# Altium schematic sheet all_in_a1.SchDoc
size 839 x 594 mm; CheckedBy: Журавлева Л. В.; Author: Синютина Д. С.; SheetNumber: 1; PageSetup: Record=PageOptions|CenterHorizontal=True|CenterVertical=True|PrintScale=0.94|XCorrection=1.00|YCorrection=1.00|PrintKind=1|BorderSize=5000000|LeftOffset=0|BottomOffset=0|Orientation=1|PaperLength=1000|PaperWidth=1000|Scale=100|PaperSource=7|PrintQuality=-4|MediaType=1|DitherType=10|PaperKind=A4|PrintScaleMode=1; DecimalNumber: ИУ4.11.03.03.21.08.81.12.003 Э3; MainDevice: ИУ4.11.03.03.21.08.81.12.024 СП; Time: 1
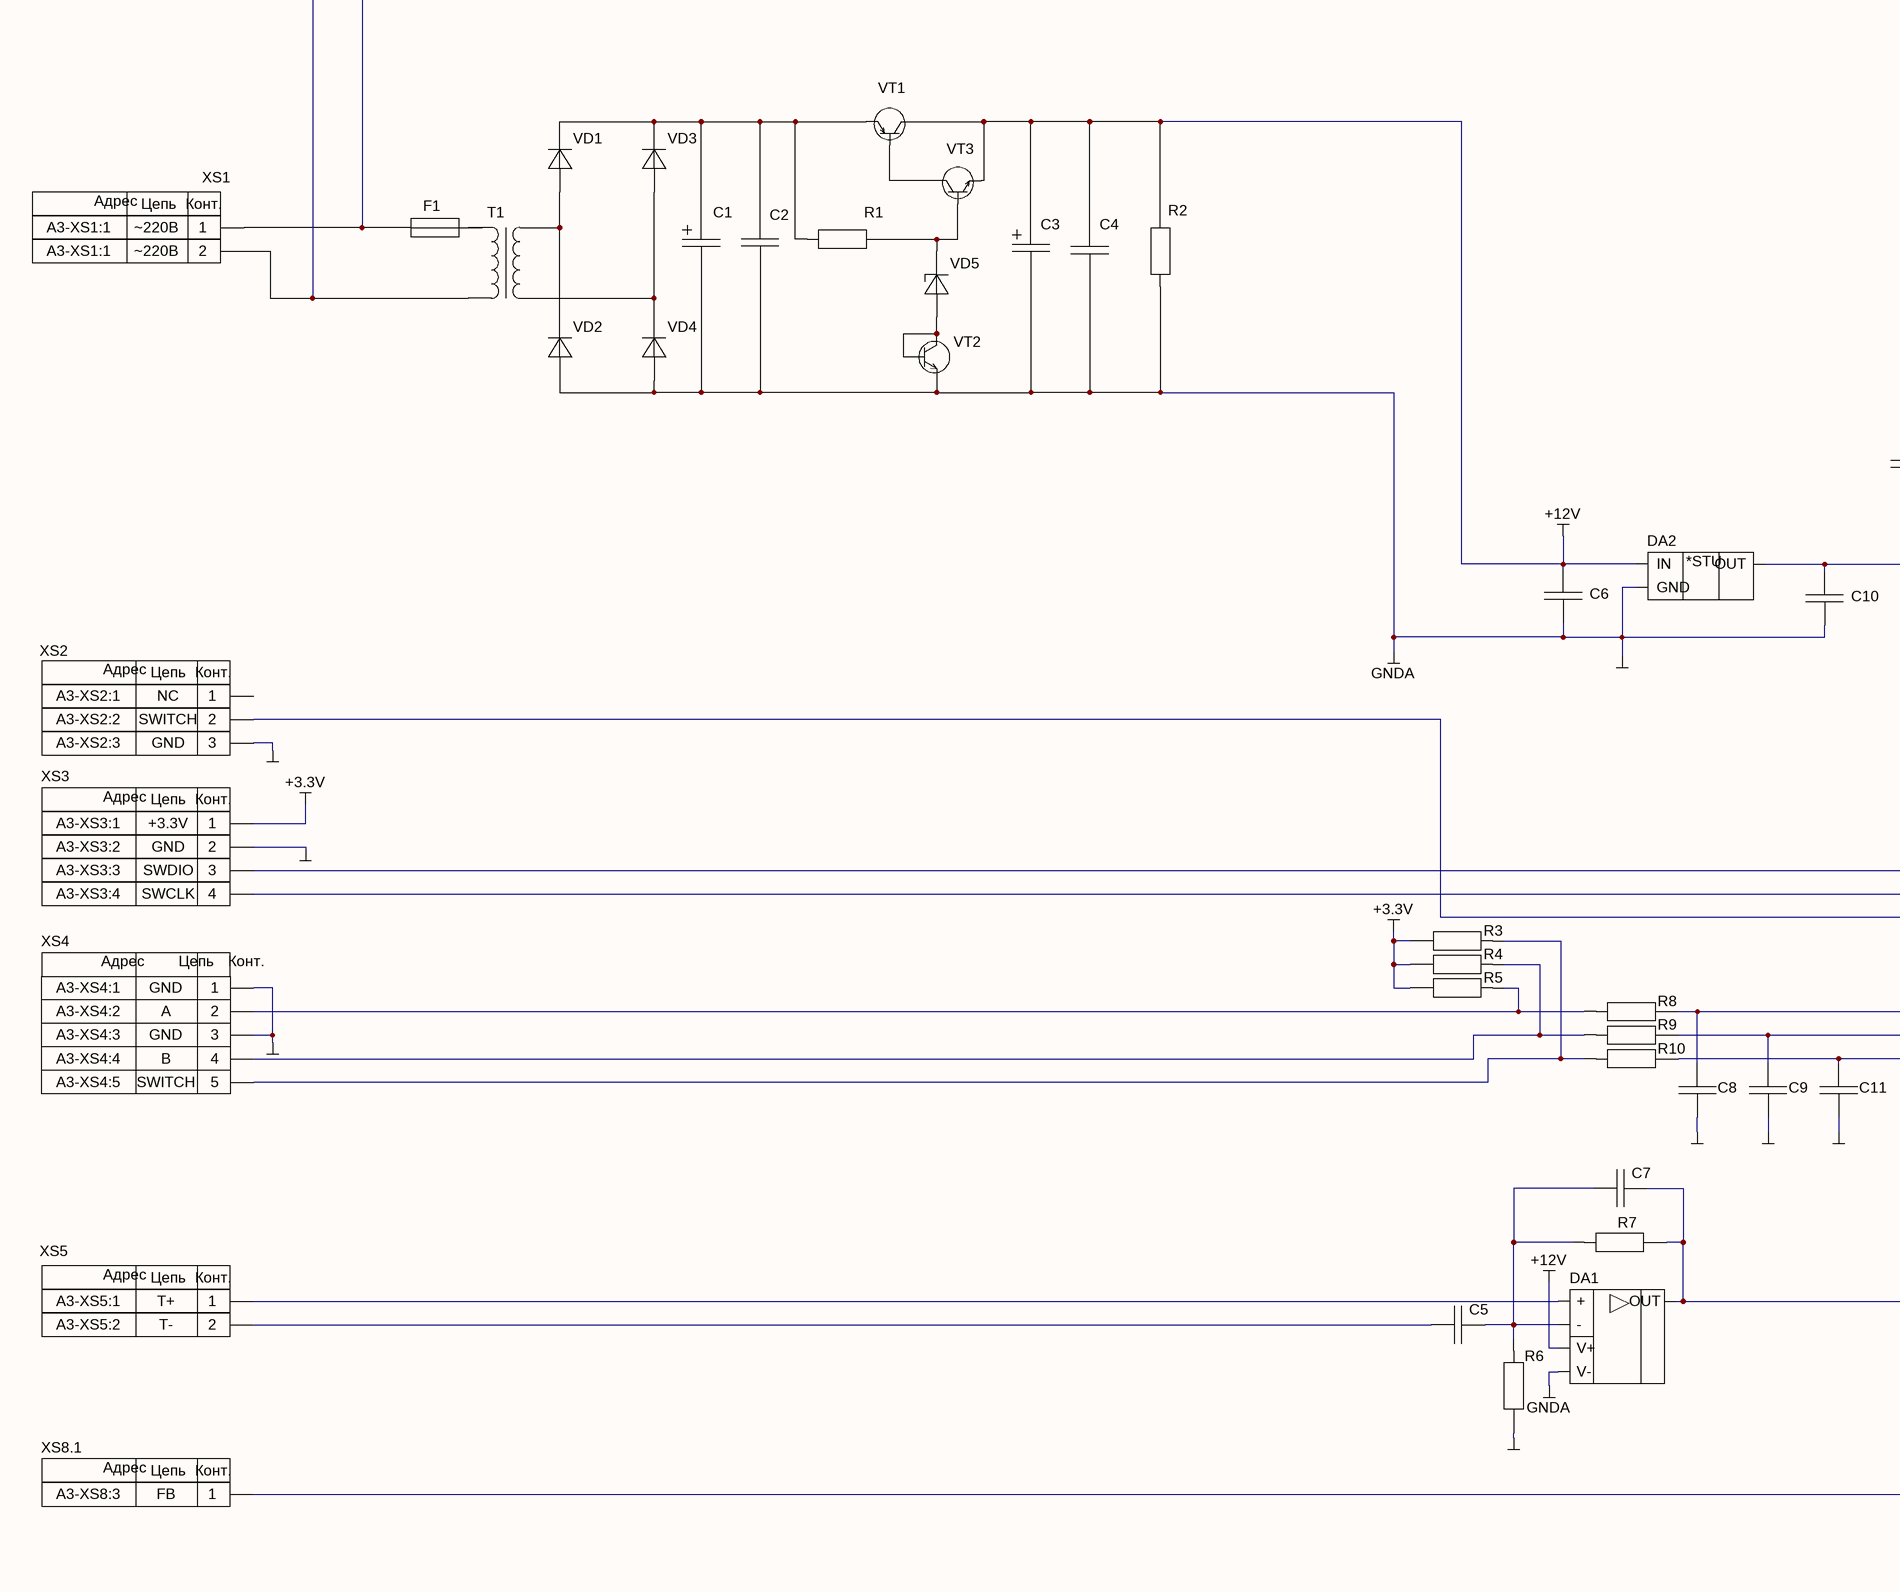
[diagram p0: all_in_a1.SchDoc, left]
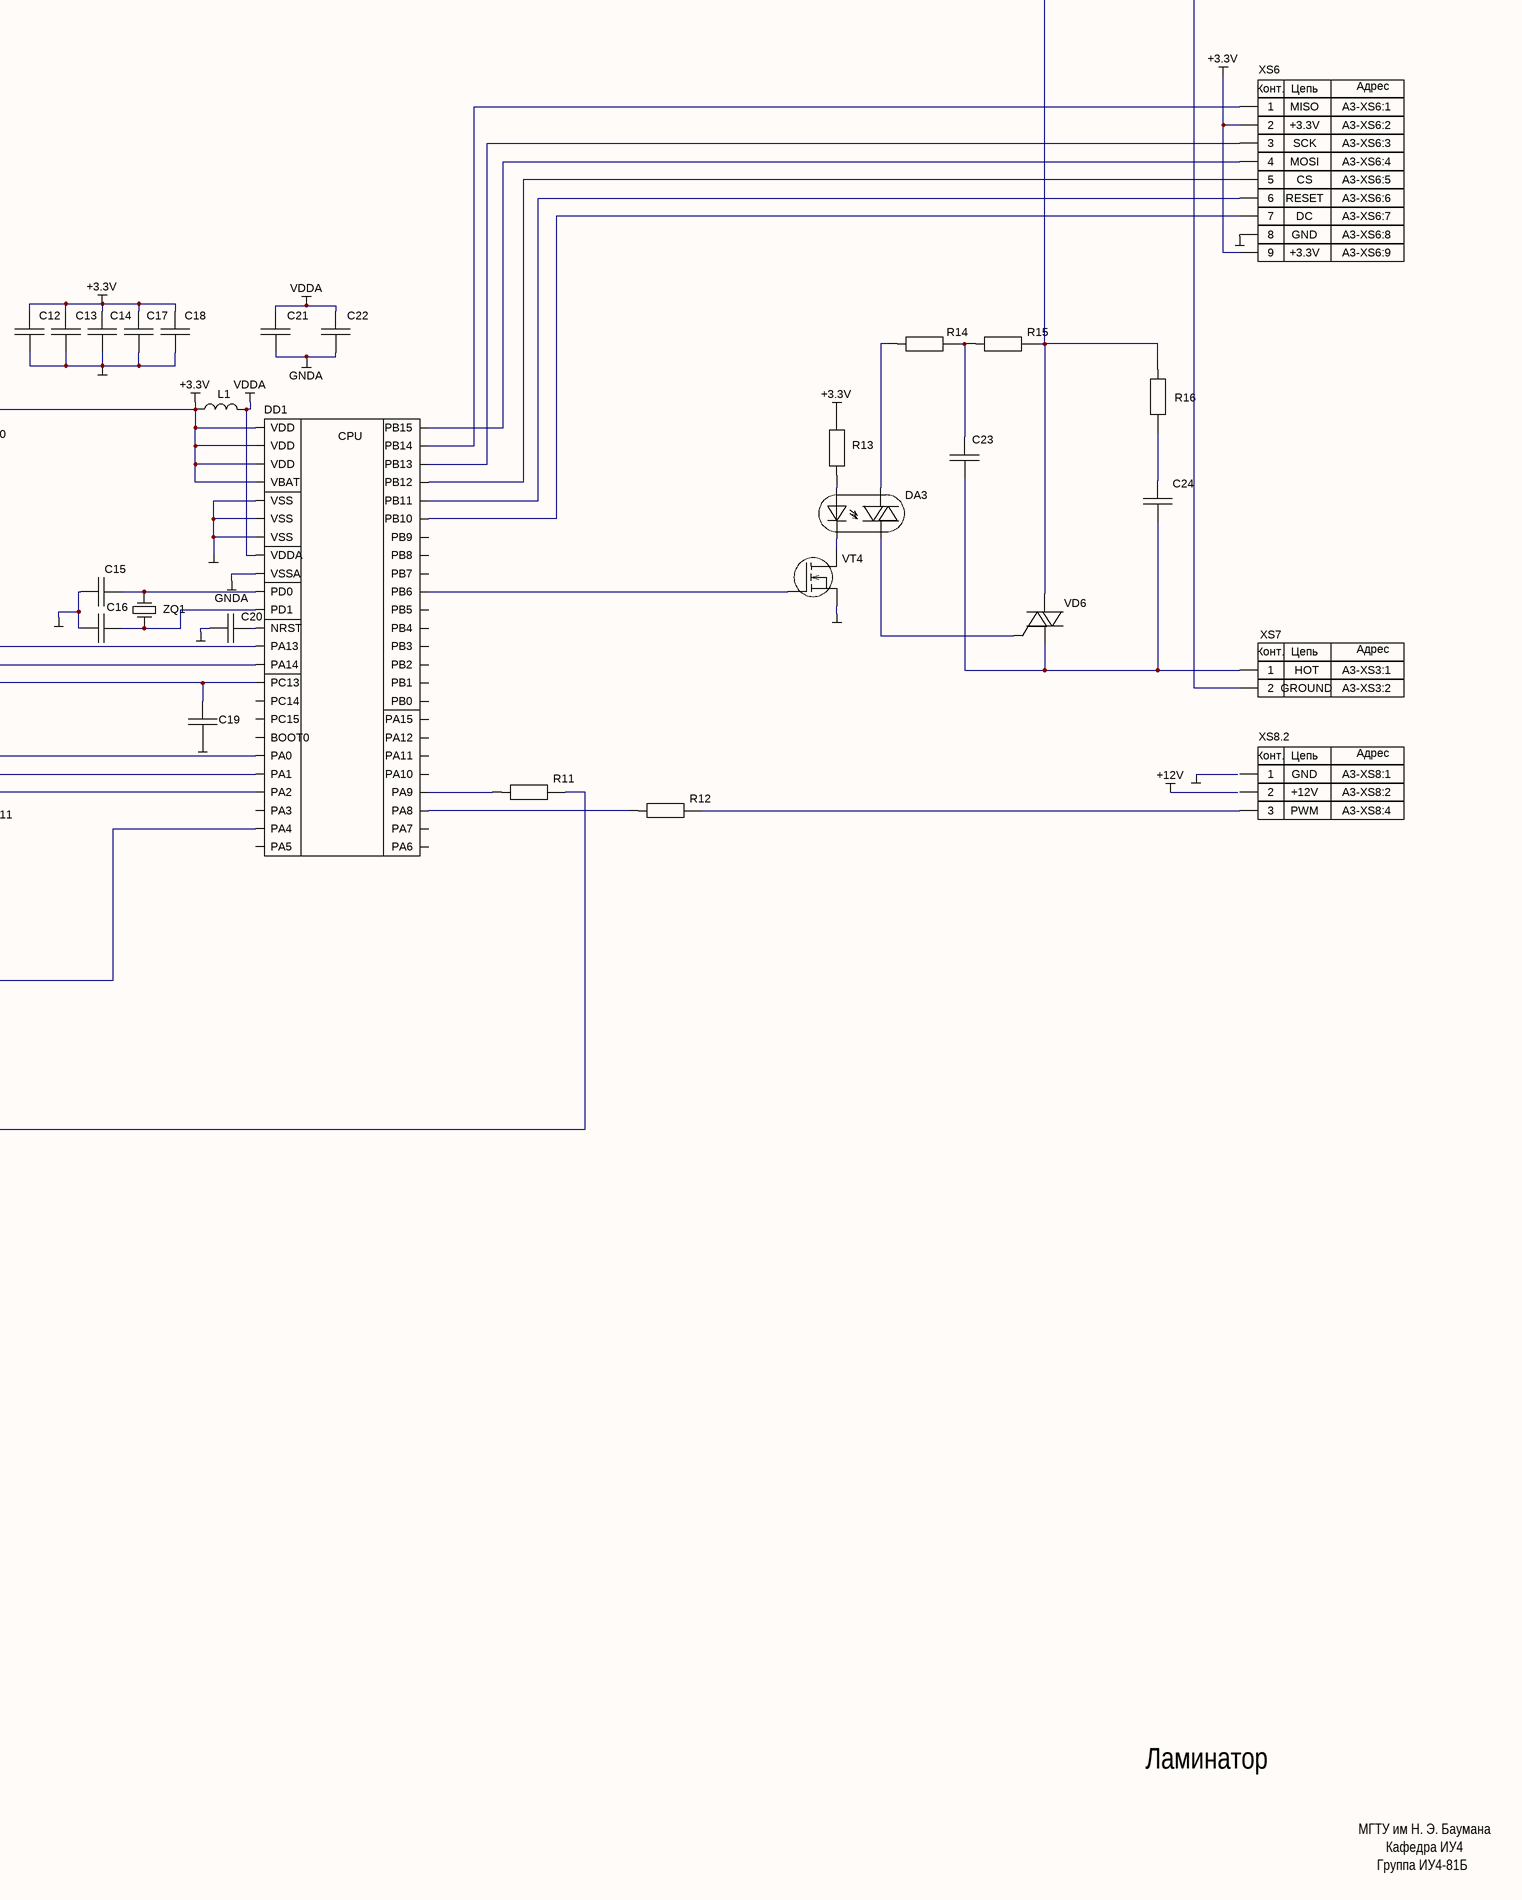
[diagram p1: all_in_a1.SchDoc, right]

## Parts
C1  1000 мкФ  [CAP: D10C5H20]  (value not drawn)
C2  100 нФ  [CAP: 1206]  (value not drawn)
C3  220 мкФ  [CAP: D6.3C2.5H11]  (value not drawn)
C4  100нФ  [CAP: 1206]  (value not drawn)
C5  100 нФ  [CAP: 0603]  (value not drawn)
C6  330 нФ  [CAP: 0603]  (value not drawn)
C7  100 нФ  [CAP: 0603]  (value not drawn)
C8  100 нФ  [CAP: 0603]  (value not drawn)
C9  100 нФ  [CAP: 0603]  (value not drawn)
C10  100 нФ  [CAP: 0603]  (value not drawn)
C11  100 нФ  [CAP: 0603]  (value not drawn)
C12  100 нФ  [CAP: 0603]  (value not drawn)
C13  100 нФ  [CAP: 0603]  (value not drawn)
C14  100 нФ  [CAP: 0603]  (value not drawn)
C15  22 pF  [CAP: 0603]  (value not drawn)
C16  22 pF  [CAP: 0603]  (value not drawn)
C17  100 нФ  [CAP: 0603]  (value not drawn)
C18  4.7 мкФ  [CAP: 0603]  (value not drawn)
C19  100 нФ  [CAP: 0603]  (value not drawn)
C20  100 нФ  [CAP: 0603]  (value not drawn)
C21  10 нФ  [CAP: 0603]  (value not drawn)
C22  1 мкФ  [CAP: 0603]  (value not drawn)
C23  10 нФ  [B32652]  (value not drawn)
C24  10 нФ  [B32652]  (value not drawn)
DA1  TS321ILT  [SOT23-5]  (value not drawn)
DA2  78xx  [SOT89]  (value not drawn)
DA3  MOC3020M  [DIP762W48P254L889H508Q6]  (value not drawn)
DD1  STM32F103C8T6  [48-LQFP]  (value not drawn)
F1  0.5 А  [FUSE: 0679H (BelFuse)]  (value not drawn)
L1  10 мкГн  [IND: 0805]  (value not drawn)
R1  330 Ом  [RES: 1206]  (value not drawn)
R2  1 кОм  [RES: 1206]  (value not drawn)
R3  10кОм  [RES: 0603]  (value not drawn)
R4  10кОм  [RES: 0603]  (value not drawn)
R5  10кОм  [RES: 0603]  (value not drawn)
R6  1 кОм  [RES: 1206]  (value not drawn)
R7  47 кОм  [RES: 1206]  (value not drawn)
R8  10кОм  [RES: 0603]  (value not drawn)
R9  10кОм  [RES: 0603]  (value not drawn)
R10  10кОм  [RES: 0603]  (value not drawn)
R11  220 Ом  [RES: 1206]  (value not drawn)
R12  220 Ом  [RES: 1206]  (value not drawn)
R13  Res  (value not drawn)
R14  Res  (value not drawn)
R15  Res  (value not drawn)
R16  Res  (value not drawn)
T1  Trans_1_1  [15v_0.7A_trans]  (value not drawn)
VD1  1n5400  [1n5400-1n5408]  (value not drawn)
VD2  1n5400  [1n5400-1n5408]  (value not drawn)
VD3  1n5400  [1n5400-1n5408]  (value not drawn)
VD4  1n5400  [1n5400-1n5408]  (value not drawn)
VD5  1n4742  [1n4728-1n4764]  (value not drawn)
VD6  BT137-600E  [TO220]  (value not drawn)
VT1  2SB1132T100Q  [SOT89]  (value not drawn)
VT2  2n4401  [TO-92]  (value not drawn)
VT3  2n4401  [TO-92]  (value not drawn)
VT4  FDV303N  [SOT23]  (value not drawn)
XS1  circuit2: ~220В  =address2: A3-XS1:1  [CON: DG350-3.5-02P]  (hidden comment: X2)
XS2  circuit1: NC  circuit2: SWITCH  circuit3: GND  =address1: A3-XS2:1  =address2: A3-XS2:2  =address3: A3-XS2:3  [CON: WF-03]  (hidden comment: X3)
XS3  circuit2: GND  circuit3: SWDIO  circuit1: +3.3V  circuit4: SWCLK  =address4: A3-XS3:4  =address3: A3-XS3:3  =address2: A3-XS3:2  =address1: A3-XS3:1  [CON: WF-04]  (hidden comment: X4)
XS4  cirtuit5: SWITCH  circuit4: B  circuit3: GND  circuit2: A  =address5: A3-XS4:5  =address4: A3-XS4:4  =address3: A3-XS4:3  =address2: A3-XS4:2  =address1: A3-XS4:1  [CON: CWF-5]  (hidden comment: X5)
XS5  circuit2: T-  circuit1: T+  =address2: A3-XS5:2  =address1: A3-XS5:1  [CON: WF-02]  (hidden comment: X2)
XS6  circtuit9: +3.3V  circtuit8: GND  circtuit7: DC  circtuit6: RESET  circtuit5: CS  circtuit4: MOSI  circtuit3: SCK  circtuit1: MISO  =address9: A3-XS6:9  =address8: A3-XS6:8  =address7: A3-XS6:7  =address5: A3-XS6:5  =address6: A3-XS6:6  =address4: A3-XS6:4  =address3: A3-XS6:3  =address2: A3-XS6:2  =address1: A3-XS6:1  [CON: IDC-10MS]  (hidden comment: X9)
XS7  circuit2: GROUND  circuit1: HOT  =address2: A3-XS3:2  =address1: A3-XS3:1  [CON: WF-02]  (hidden comment: X2)
XS8.1  address: A3-XS8:3  circuit: FB  (hidden comment: X1)
XS8.2  circuit1: GND  circuit2: +12V  circuit3: PWM  =address1: A3-XS8:1  =address2: A3-XS8:2  =address3: A3-XS8:4  (hidden comment: X3)
ZQ1  AT-41CD2-8MHz  [AT-41CD2]  (value not drawn)

## Nets
+3.3V: C10.2 C12.2 C13.2 C14.2 C17.2 C18.2 DA2.2(OUT) DD1.1(VBAT) DD1.24(VDD) DD1.36(VDD) DD1.48(VDD) L1.1 R3.2 R4.2 R5.2 R13.2 XS3.1 XS6.2 XS6.9
+12V: C3.1 C4.1 C6.2 DA1.5(V+) DA2.1(IN) R2.2 VT1.2(c) VT3.3(e)
GND: C1.2 C2.1 C3.2 C4.2 C6.1 C8.1 C9.1 C10.1 C11.1 C12.1 C13.1 C14.1 C15.1 C16.1 C17.1 C18.1 C19.1 C20.1 C21.1 C22.1 DA1.2(V-) DA2.3(GND) DD1.8(VSSA) DD1.23(VSS) DD1.35(VSS) DD1.47(VSS) R2.1 R6.2 VD2.1 VD4.1 VT2.3(e) VT4.3 XS2.3 XS3.2 XS4.1 XS4.3 XS6.8  [also labelled GNDA]
VDDA: C21.2 C22.2 DD1.9(VDDA) L1.2
NetC1_1: C1.1 C2.2 R1.1 VD1.2 VD3.2 VT1.3(e)
NetC5_1: C5.1 XS5.2
NetC5_2: C5.2 C7.1 DA1.3(-) R6.1 R7.1
NetC7_2: C7.2 DA1.4(OUT) DD1.14(PA4) R7.2
NetC8_2: C8.2 DD1.10(PA0) R8.2
NetC9_2: C9.2 DD1.11(PA1) R9.2
NetC11_2: C11.2 DD1.12(PA2) R10.2
NetC15_2: C15.2 DD1.5(PD0) ZQ1.1
NetC16_2: C16.2 DD1.6(PD1) ZQ1.2
NetC19_2: C19.2 DD1.2(PC13) XS2.2
NetC20_2: C20.2 DD1.7(NRST)
NetC23_1: C23.1 C24.1 VD6.1 XS7.1
NetC23_2: C23.2 R14.2 R15.1
NetC24_2: C24.2 R16.2
NetDA1_1: DA1.1(+) XS5.1
NetDA3_1: DA3.1 R13.1
NetDA3_2: DA3.2 VT4.2
NetDA3_3: DA3.3 R14.1
NetDA3_4: DA3.4 VD6.3
NetDD1_21: DD1.21(PB10) XS6.7
NetDD1_22: DD1.22(PB11) XS6.6
NetDD1_25: DD1.25(PB12) XS6.5
NetDD1_26: DD1.26(PB13) XS6.3
NetDD1_27: DD1.27(PB14) XS6.1
NetDD1_28: DD1.28(PB15) XS6.4
NetDD1_29: DD1.29(PA8) R12.1
NetDD1_30: DD1.30(PA9) R11.1
NetDD1_34: DD1.34(PA13) XS3.3
NetDD1_37: DD1.37(PA14) XS3.4
NetDD1_42: DD1.42(PB6) VT4.1
NetF1_1: F1.1 R15.2 R16.1 VD6.2 XS1.1
NetF1_2: F1.2 T1.1
NetR1_2: R1.2 VD5.2 VT3.1(b)
NetR3_1: R3.1 R10.1 XS4.5
NetR4_1: R4.1 R9.1 XS4.4
NetR5_1: R5.1 R8.1 XS4.2
NetR11_2: R11.2 XS8.1.1
NetR12_2: R12.2 XS8.2.3
NetT1_2: T1.2 XS1.2 XS7.2
NetT1_3: T1.3 VD1.1 VD2.2
NetT1_4: T1.4 VD3.1 VD4.2
NetVD5_1: VD5.1 VT2.1(b) VT2.2(c)
NetVT1_1: VT1.1(b) VT3.2(c)

Not connected (* = marked no-connect by the designer): DD1 3(PC14) 4(PC15) 13(PA3) 15(PA5) 16(PA6) 17(PA7) 18(PB0) 19(PB1) 20(PB2) 31(PA10) 32(PA11) 33(PA12) 38(PA15) 39(PB3) 40(PB4) 41(PB5) 43(PB7) 44(BOOT0) 45(PB8) 46(PB9); XS2 1; XS8.2 1 2

## Notes on the sheet
- Ламинатор
- МГТУ им Н. Э. Баумана
- Кафедра ИУ4
- Группа ИУ4-81Б
- Перв.примен.
- Справ.№
- Подп. и дата
- Инв.№ дубл.
- Взам.инв.№
- Подп.и дата
- Разраб.
- Изм.
- Лист
- № докум.
- Подп.
- Дата
- Лит.
- Масштаб
- Масса
- Т.контр.
- Пров.
- СХЕМА   ЭЛЕКТРИЧЕСКАЯ
- ПРИНЦИПИАЛЬНАЯ
- Листов
- Инв.№ подл.
- Утв.
- Н.контр.
- Нач.сект.
- Формат  A1
- (in symbol 78xx) *STU
- (in symbol STM32F103C8T6) CPU
- (in symbol X1) Цепь; Конт.; Адрес
- (in symbol X2) Цепь; Конт.; Адрес
- (in symbol X3) Цепь; Конт.; Адрес
- (in symbol X4) Цепь; Конт.; Адрес
- (in symbol X5) Адрес; Цепь; Конт.
- (in symbol X9) Конт.; Цепь; Адрес

## Library data of the parts
C1 C3 = C_pol
C2 C4-C24 = C_const
DA1 = single_channel_op_amp: pin to pad: 1>3 3>4 4>1
DA2 = 78xx: pin to pad: 1>3 2>1 3>2
DA3 = opto_triak: pin to pad: 3>6
F1 = fuse
L1 = L
R1-R12 = Res
T1 = Trans_1_1: pin to pad: 4>5
VD1-VD4 = VD
VD5 = zener
VD6 = triac
VT1 = pnp
VT2 VT3 = npn: pin to pad: 1>2 2>3 3>1
VT4 = n-mosfet: pin to pad: 2>3 3>2
XS5 = X2: pin to pad: 1>2 2>1
ZQ1 = ZQ
XS1 XS7 = X2
  XS1: circuit1: ~220В; =address1: A3-XS1:1
XS4 = X5: circuit1: GND
XS6 = X9: circtuit2: +3.3V